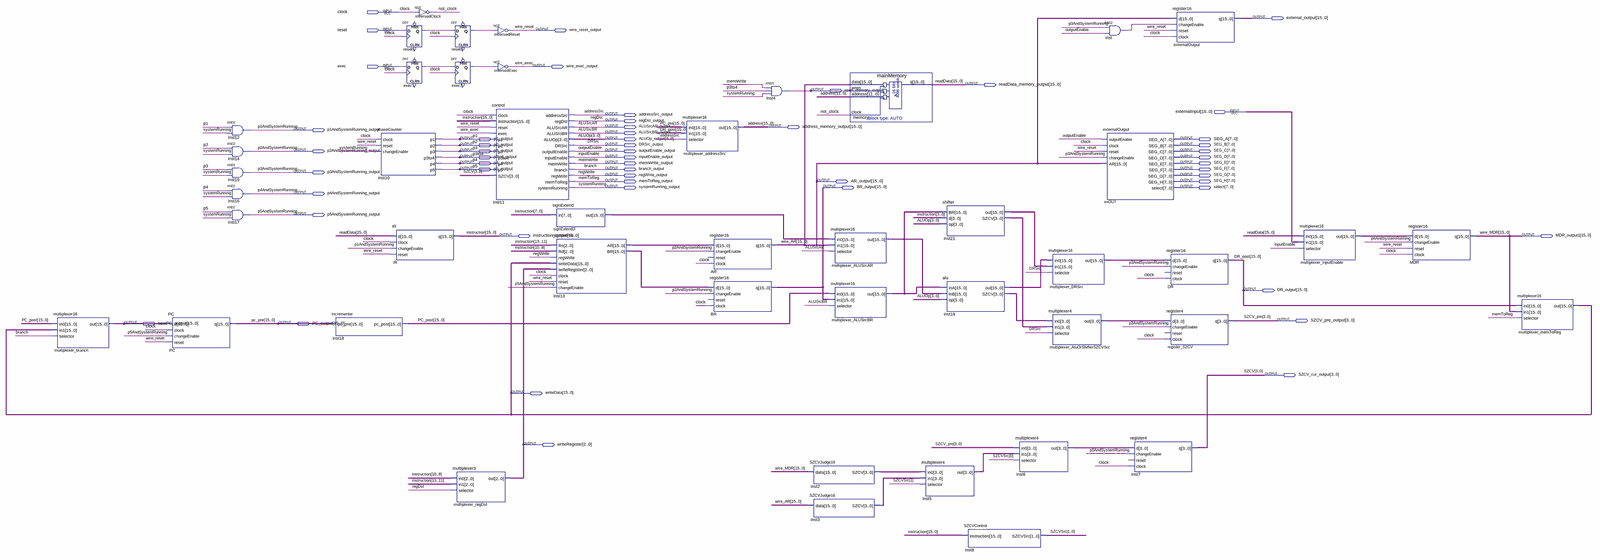
[diagram p0: schematic sheet, whole]
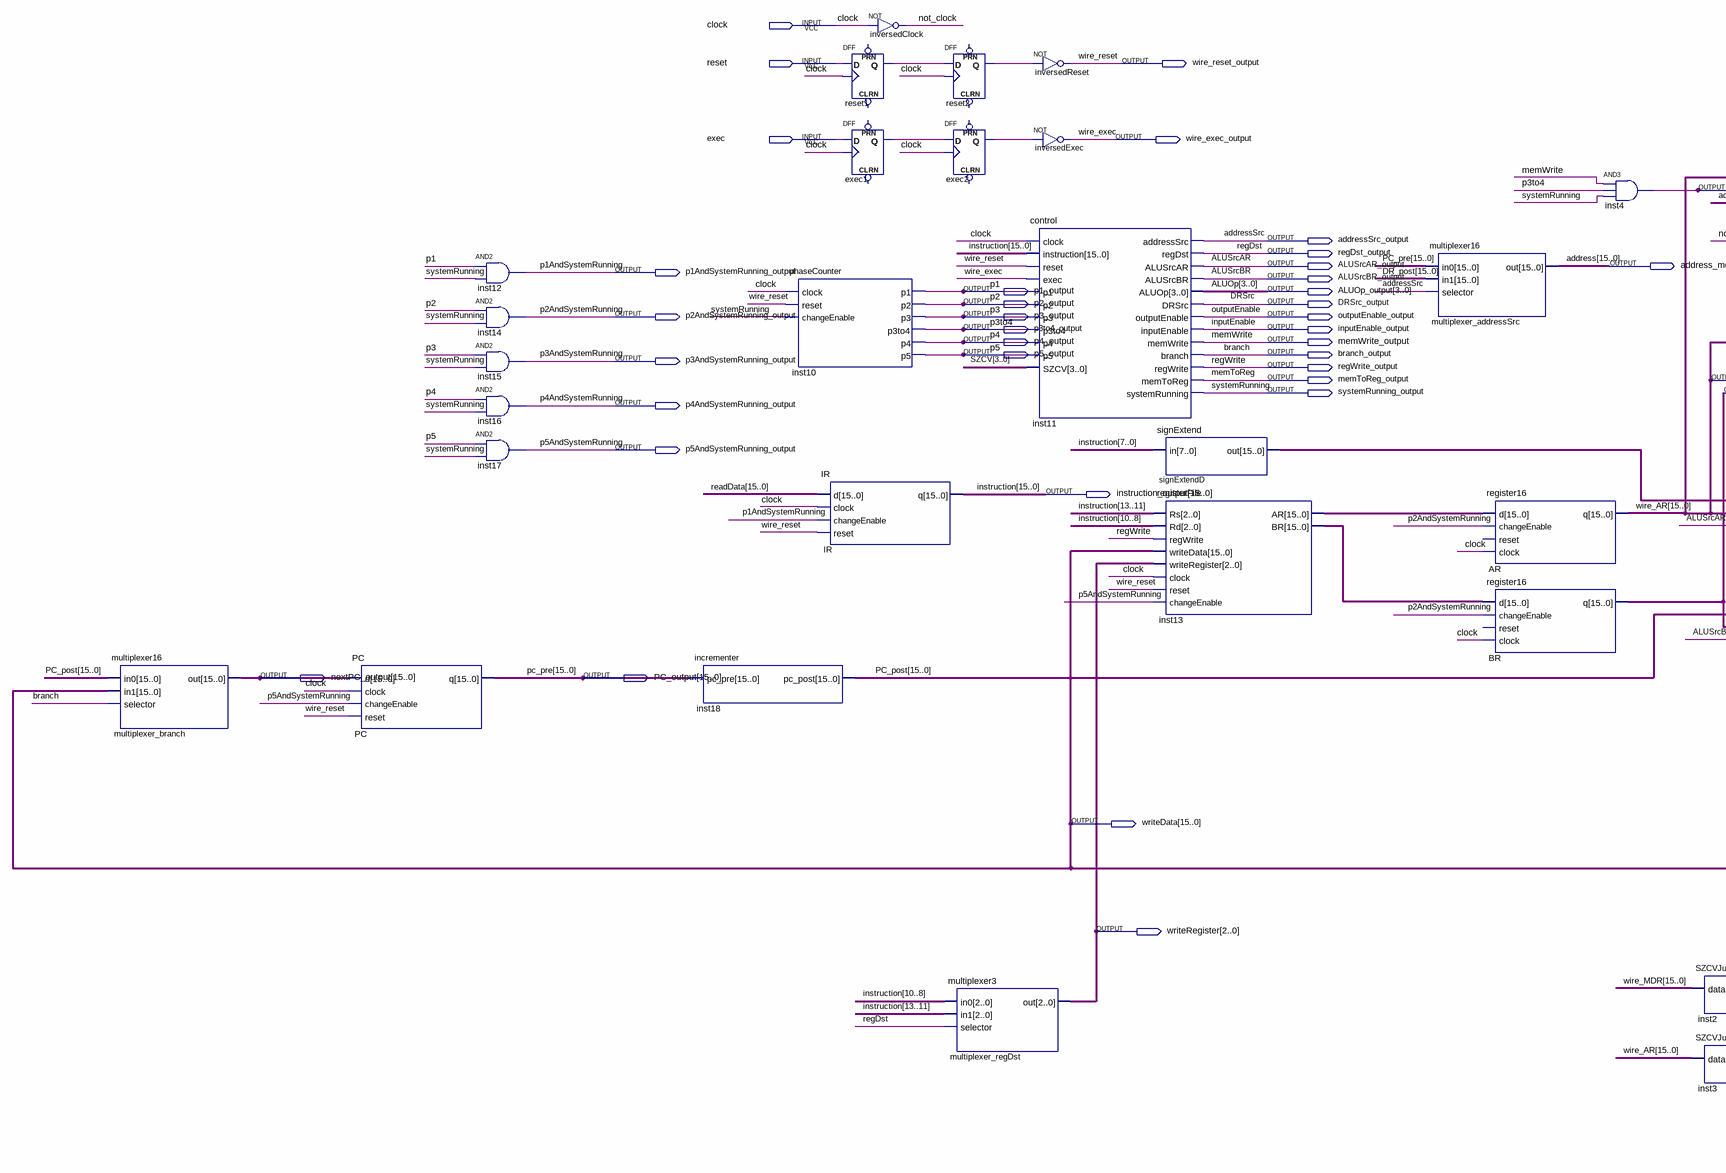
[diagram p1: schematic sheet, left part]
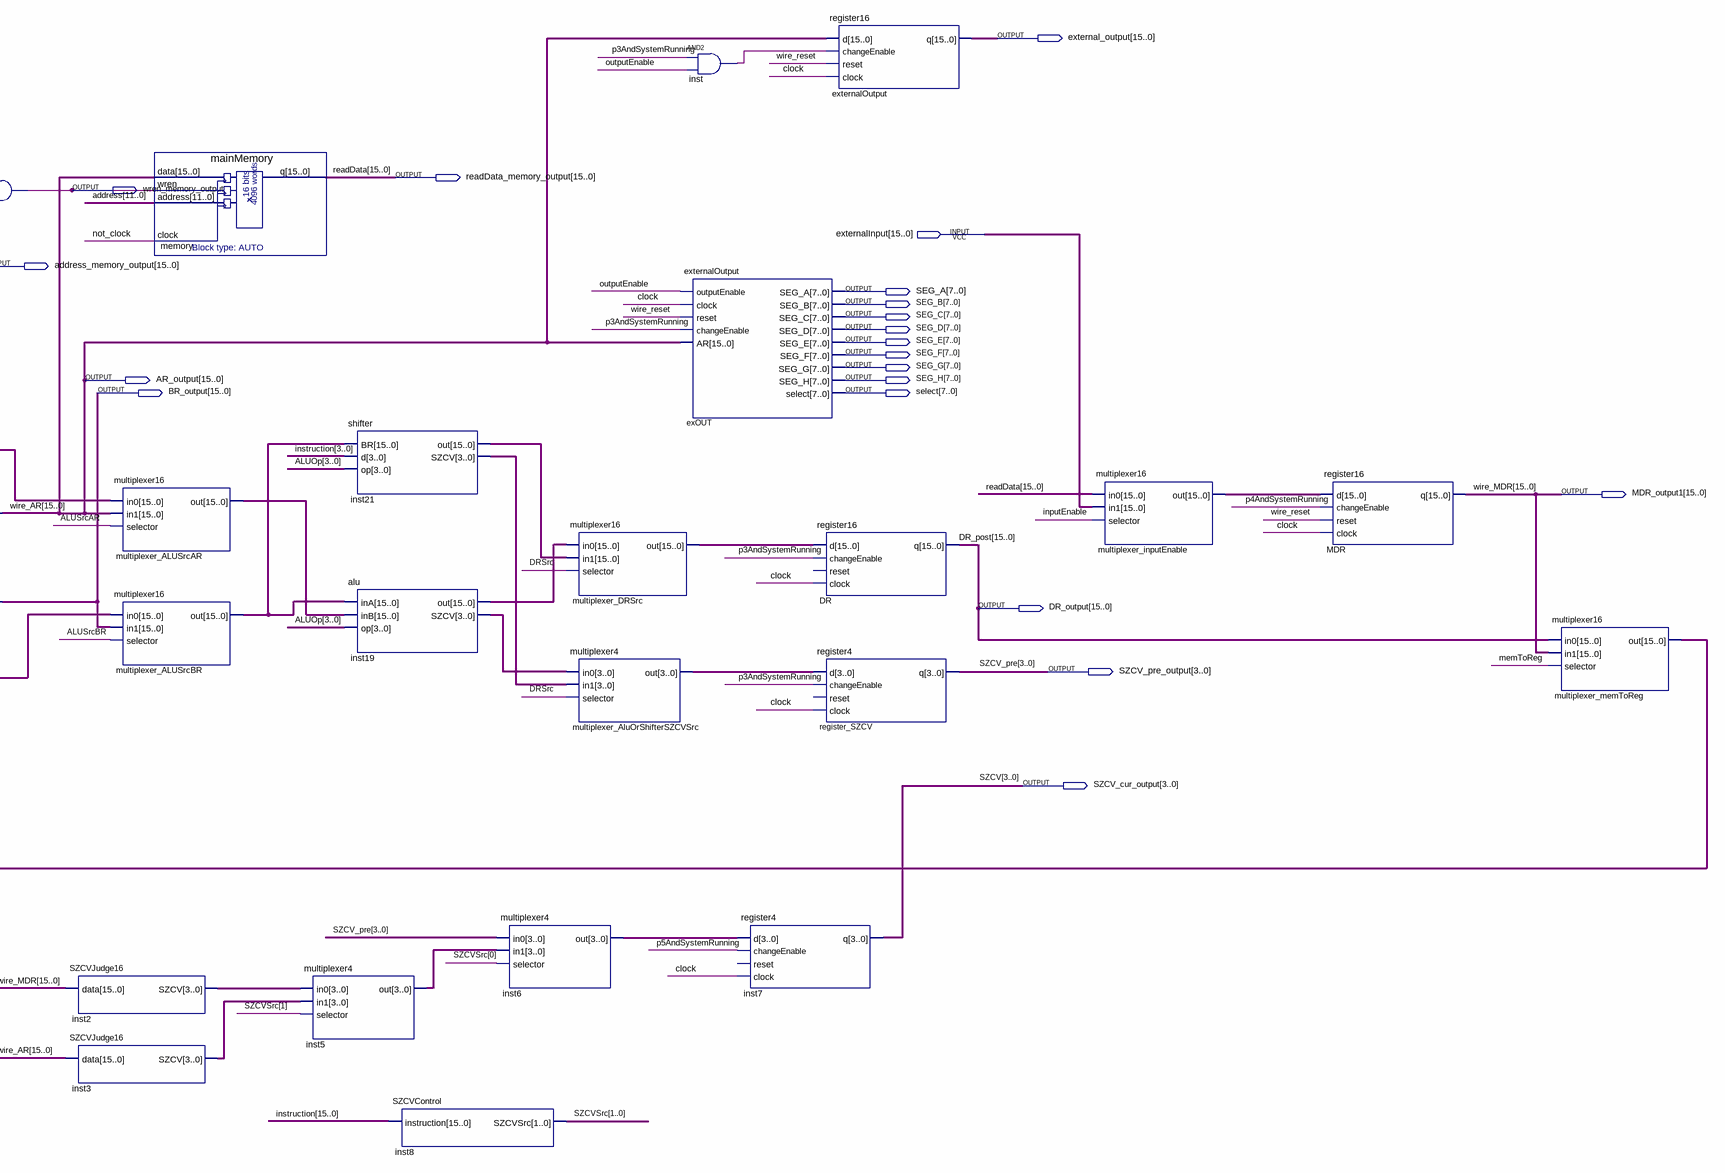
[diagram p2: schematic sheet, right part]
// Quartus schematic processor.bdf as structural Verilog: 46 symbols, 54 pins
module processor (
  input  clock,
  input  reset,
  input  exec,
  input  [15:0] externalInput,
  output [15:0] external_output,
  output wire_reset_output,
  output wire_exec_output,
  output [15:0] readData_memory_output,
  output wren_memory_output,
  output addressSrc_output,
  output regDst_output,
  output ALUSrcAR_output,
  output [15:0] address_memory_output,
  output p1AndSystemRunning_output,
  output ALUSrcBR_output,
  output p1_output,
  output [3:0] ALUOp_output,
  output [7:0] SEG_A,
  output p2_output,
  output DRSrc_output,
  output [7:0] SEG_B,
  output p2AndSystemRunning_output,
  output p3_output,
  output outputEnable_output,
  output [7:0] SEG_C,
  output p3to4_output,
  output inputEnable_output,
  output [7:0] SEG_D,
  output p4_output,
  output memWrite_output,
  output [7:0] SEG_E,
  output p5_output,
  output branch_output,
  output [7:0] SEG_F,
  output p3AndSystemRunning_output,
  output regWrite_output,
  output [7:0] SEG_G,
  output memToReg_output,
  output [15:0] AR_output,
  output [7:0] SEG_H,
  output systemRunning_output,
  output [15:0] BR_output,
  output [7:0] select,
  output p4AndSystemRunning_output,
  output p5AndSystemRunning_output,
  output [15:0] instruction_output,
  output [15:0] MDR_output1,
  output [15:0] DR_output,
  output [3:0] SZCV_pre_output,
  output [15:0] nextPC_output,
  output [15:0] PC_output,
  output [3:0] SZCV_cur_output,
  output [15:0] writeData,
  output [2:0] writeRegister
);

  wire exec1_q, exec2_q, inst_out, not_clock, reset1_q, reset2_q;
  wire [1:0] SZCVSrc;
  wire [3:0] inst2_szcv, inst3_szcv, inst5_out, inst6_out, inst19_szcv, inst21_szcv,
       multiplexer_AluOrShifterSZCVSrc_out;
  wire [15:0] inst13_ar, inst13_br, inst19_out, inst21_out, multiplexer_ALUSrcAR_out,
       multiplexer_ALUSrcBR_out, multiplexer_DRSrc_out, multiplexer_inputEnable_out, PC_post, signExtendD_out;

  multiplexer16 multiplexer_branch (.in0(PC_post), .in1(writeData), .selector(branch_output), .out(nextPC_output));
  PC PC (
    .d(nextPC_output), .clock(clock), .changeEnable(p5AndSystemRunning_output), .reset(wire_reset_output),
    .q(PC_output));
  and inst12 (p1AndSystemRunning_output, p1_output, systemRunning_output);
  and inst14 (p2AndSystemRunning_output, p2_output, systemRunning_output);
  and inst15 (p3AndSystemRunning_output, p3_output, systemRunning_output);
  and inst16 (p4AndSystemRunning_output, p4_output, systemRunning_output);
  and inst17 (p5AndSystemRunning_output, p5_output, systemRunning_output);
  incrementer inst18 (.pc_pre(PC_output), .pc_post(PC_post));
  phaseCounter inst10 (
    .clock(clock), .reset(wire_reset_output), .changeEnable(systemRunning_output), .p1(p1_output),
    .p2(p2_output), .p3(p3_output), .p3to4(p3to4_output), .p4(p4_output), .p5(p5_output));
  IR IR (
    .d(readData_memory_output), .clock(clock), .changeEnable(p1AndSystemRunning_output),
    .reset(wire_reset_output), .q(instruction_output));
  not inversedClock (not_clock, clock);
  DFF reset1 (.CLK(clock), .D(reset), .Q(reset1_q));  // open: CLRN, PRN
  DFF exec1 (.CLK(clock), .D(exec), .Q(exec1_q));  // open: CLRN, PRN
  DFF reset2 (.CLK(clock), .D(reset1_q), .Q(reset2_q));  // open: CLRN, PRN
  DFF exec2 (.CLK(clock), .D(exec1_q), .Q(exec2_q));  // open: CLRN, PRN
  multiplexer3 multiplexer_regDst (
    .in0(instruction_output[10:8]), .in1(instruction_output[13:11]), .selector(regDst_output),
    .out(writeRegister));
  not inversedReset (wire_reset_output, reset2_q);
  not inversedExec (wire_exec_output, exec2_q);
  control inst11 (
    .clock(clock), .instruction(instruction_output), .reset(wire_reset_output), .exec(wire_exec_output),
    .p1(p1_output), .p2(p2_output), .p3(p3_output), .p3to4(p3to4_output), .p4(p4_output), .p5(p5_output),
    .SZCV(SZCV_cur_output), .addressSrc(addressSrc_output), .regDst(regDst_output),
    .ALUSrcAR(ALUSrcAR_output), .ALUSrcBR(ALUSrcBR_output), .ALUOp(ALUOp_output), .DRSrc(DRSrc_output),
    .outputEnable(outputEnable_output), .inputEnable(inputEnable_output), .memWrite(memWrite_output),
    .branch(branch_output), .regWrite(regWrite_output), .memToReg(memToReg_output),
    .systemRunning(systemRunning_output));
  signExtend signExtendD (.in(instruction_output[7:0]), .out(signExtendD_out));
  registerFile inst13 (
    .Rs(instruction_output[13:11]), .Rd(instruction_output[10:8]), .regWrite(regWrite_output),
    .writeData(writeData), .writeRegister(writeRegister), .clock(clock), .reset(wire_reset_output),
    .changeEnable(p5AndSystemRunning_output), .AR(inst13_ar), .BR(inst13_br));
  multiplexer16 multiplexer_addressSrc (
    .in0(PC_output), .in1(DR_output), .selector(addressSrc_output), .out(address_memory_output));
  register16 AR (.d(inst13_ar), .changeEnable(p2AndSystemRunning_output), .clock(clock), .q(AR_output));  // open: reset
  register16 BR (.d(inst13_br), .changeEnable(p2AndSystemRunning_output), .clock(clock), .q(BR_output));  // open: reset
  and inst4 (wren_memory_output, memWrite_output, p3to4_output, systemRunning_output);
  SZCVJudge16 inst2 (.data(MDR_output1), .SZCV(inst2_szcv));
  SZCVJudge16 inst3 (.data(AR_output), .SZCV(inst3_szcv));
  multiplexer16 multiplexer_ALUSrcAR (
    .in0(signExtendD_out), .in1(AR_output), .selector(ALUSrcAR_output), .out(multiplexer_ALUSrcAR_out));
  multiplexer16 multiplexer_ALUSrcBR (
    .in0(PC_post), .in1(BR_output), .selector(ALUSrcBR_output), .out(multiplexer_ALUSrcBR_out));
  mainMemory memory (
    .data(AR_output), .wren(wren_memory_output), .address(address_memory_output[11:0]), .clock(not_clock),
    .q(readData_memory_output));
  multiplexer4 inst5 (.in0(inst2_szcv), .in1(inst3_szcv), .selector(SZCVSrc[1]), .out(inst5_out));
  shifter inst21 (
    .BR(multiplexer_ALUSrcBR_out), .d(instruction_output[3:0]), .op(ALUOp_output), .out(inst21_out),
    .SZCV(inst21_szcv));
  alu inst19 (
    .inA(multiplexer_ALUSrcBR_out), .inB(multiplexer_ALUSrcAR_out), .op(ALUOp_output), .out(inst19_out),
    .SZCV(inst19_szcv));
  SZCVControl inst8 (.instruction(instruction_output), .SZCVSrc(SZCVSrc));
  multiplexer4 inst6 (.in0(SZCV_pre_output), .in1(inst5_out), .selector(SZCVSrc[0]), .out(inst6_out));
  multiplexer16 multiplexer_DRSrc (
    .in0(inst19_out), .in1(inst21_out), .selector(DRSrc_output), .out(multiplexer_DRSrc_out));
  multiplexer4 multiplexer_AluOrShifterSZCVSrc (
    .in0(inst19_szcv), .in1(inst21_szcv), .selector(DRSrc_output), .out(multiplexer_AluOrShifterSZCVSrc_out));
  externalOutput exOUT (
    .outputEnable(outputEnable_output), .clock(clock), .reset(wire_reset_output),
    .changeEnable(p3AndSystemRunning_output), .AR(AR_output), .SEG_A(SEG_A), .SEG_B(SEG_B), .SEG_C(SEG_C),
    .SEG_D(SEG_D), .SEG_E(SEG_E), .SEG_F(SEG_F), .SEG_G(SEG_G), .SEG_H(SEG_H), .select(select));
  and inst (inst_out, p3AndSystemRunning_output, outputEnable_output);
  register4 inst7 (
    .d(inst6_out), .changeEnable(p5AndSystemRunning_output), .clock(clock), .q(SZCV_cur_output));  // open: reset
  register16 externalOutput (
    .d(AR_output), .changeEnable(inst_out), .reset(wire_reset_output), .clock(clock), .q(external_output));
  register16 DR (
    .d(multiplexer_DRSrc_out), .changeEnable(p3AndSystemRunning_output), .clock(clock), .q(DR_output));  // open: reset
  register4 register_SZCV (
    .d(multiplexer_AluOrShifterSZCVSrc_out), .changeEnable(p3AndSystemRunning_output), .clock(clock),
    .q(SZCV_pre_output));  // open: reset
  multiplexer16 multiplexer_inputEnable (
    .in0(readData_memory_output), .in1(externalInput), .selector(inputEnable_output),
    .out(multiplexer_inputEnable_out));
  register16 MDR (
    .d(multiplexer_inputEnable_out), .changeEnable(p4AndSystemRunning_output), .reset(wire_reset_output),
    .clock(clock), .q(MDR_output1));
  multiplexer16 multiplexer_memToReg (.in0(DR_output), .in1(MDR_output1), .selector(memToReg_output), .out(writeData));

  // Other names for the same wires on the sheet: address[15:0] = address_memory_output;
  //   addressSrc = addressSrc_output; ALUOp[3:0] = ALUOp_output; ALUSrcAR = ALUSrcAR_output;
  //   ALUSrcBR = ALUSrcBR_output; wire_AR[15:0] = AR_output; branch = branch_output; DR_post[15:0] = DR_output;
  //   DRSrc = DRSrc_output; inputEnable = inputEnable_output; instruction[15:0] = instruction_output;
  //   wire_MDR[15:0] = MDR_output1; memToReg = memToReg_output; memWrite = memWrite_output;
  //   outputEnable = outputEnable_output; p1 = p1_output; p1AndSystemRunning = p1AndSystemRunning_output;
  //   p2 = p2_output; p2AndSystemRunning = p2AndSystemRunning_output; p3 = p3_output;
  //   p3AndSystemRunning = p3AndSystemRunning_output; p3to4 = p3to4_output; p4 = p4_output;
  //   p4AndSystemRunning = p4AndSystemRunning_output; p5 = p5_output; p5AndSystemRunning = p5AndSystemRunning_output;
  //   PC_pre[15:0] = PC_output; readData[15:0] = readData_memory_output; regDst = regDst_output;
  //   regWrite = regWrite_output; systemRunning = systemRunning_output; SZCV[3:0] = SZCV_cur_output;
  //   SZCV_pre[3:0] = SZCV_pre_output; wire_exec = wire_exec_output; wire_reset = wire_reset_output
endmodule
